# Altium project Homework.PrjPcb
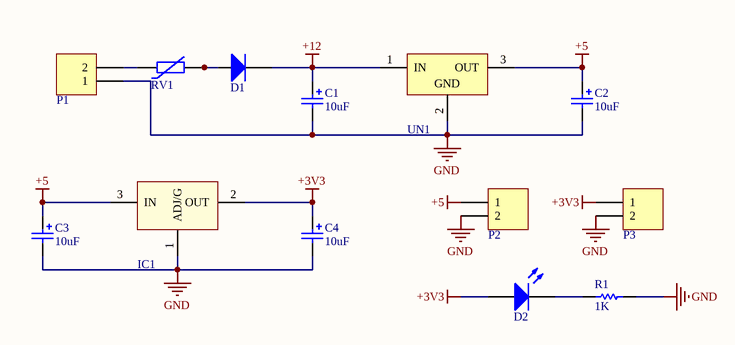
[diagram p0: Homework.SchDoc]
1 sheet, 13 parts. Net scope: global (net labels, ports and power ports of the same name join across sheets).
Board files: Homework.PcbDoc, MachNguon.PcbDoc

## Sheet Homework.SchDoc
size A; SheetNumber: 1; SheetTotal: 1

### Parts
C1  value 10uF  [CP1/2]  (hidden comment: Cap Pol)
C2  value 10uF  [CP1/2]  (hidden comment: Cap Pol)
C3  value 10uF  [CP1/2]  (hidden comment: Cap Pol)
C4  value 10uF  [CP1/2]  (hidden comment: Cap Pol)
D1  Diode  [D1A]  (value not drawn)
D2  LED  [LED-3mm]  (value not drawn)
IC1  LM1117  [QTO-220]  (value not drawn)
P1  Domino 2  [DOMINO 2- 5mm]  (value not drawn)
P2  Domino 2  [DOMINO 2- 5mm]  (value not drawn)
P3  Domino 2  [DOMINO 2- 5mm]  (value not drawn)
R1  value 1K  [RES 1/2W]  (hidden comment: RESISTOR)
RV1  14VAC, 18VDC  [D9W4.5H12P0.8]  (value not drawn)
UN1  LM7805  [QTO-220]  (value not drawn)

### Nets
+3V3: C4.1 D2.1(A) IC1.2(OUT) P3.1
+5: C2.1 C3.1 IC1.3(IN) P2.1 UN1.3(OUT)
+12: C1.1 D1.2(K) UN1.1(IN)
GND: C1.2 C2.2 C3.2 C4.2 IC1.1(ADJ/G) P1.1 P2.2 P3.2 R1.2 UN1.2(GND)
NetD1_1: D1.1(A) RV1.2
NetD2_2: D2.2(K) R1.1
NetP1_2: P1.2 RV1.1

### Library data of the parts
C1-C4 = Cap Pol: Polarized Capacitor (Radial)
D1 = Diode: Default Diode
IC1 = LM1117: Available in 1.8V, 2.5V, 2.85V, 3.3V, 5V, and  Adjustable Versions; Value: LM317
P1-P3 = Domino 2: Domino, 2-Pin; LatestRevisionDate: 17-Jul-2002; LatestRevisionNote: Re-released for DXP Platform.; Publisher: Altium Limited
RV1 = 820571406: WE-VD Disk Varistor, THT, 14VAC, 18VDC, 2930pF; Manufacturer: Wurth Elektronik; Clamping Voltage: 43V; Energy Absorption: 1.4J; Operating Voltage (AC): 14V; Operating Voltage (DC): 18V; Pitch: 0.8mm; Power Dissipation: 0.02W; (Reverse) Breakdown Voltage: 22V; (Reverse) Peak Pulse Current: 250A; Manufacturer Part Number: 820571406; Category: Surge Protection; Match Code: WE-VD; ComponentLink1Description: Website Link; ComponentLink1URL: https://www.we-online.com/redexpert/article/820571406?ad; ComponentLink2Description: Datasheet Link; ComponentLink2URL: https://www.we-online.com/redexpert/spec/820571406?ad; Mount: Through Hole; Operating Temperature Max: 85°C; Operating Temperature Min: -40°C; Packaging: Tape and Reel; Width: 4.5mm; Height: 12mm; Diameter: 9mm; Channel Input Capacitance: 2930pF
UN1 = LM7805: Positive Voltage Regulator